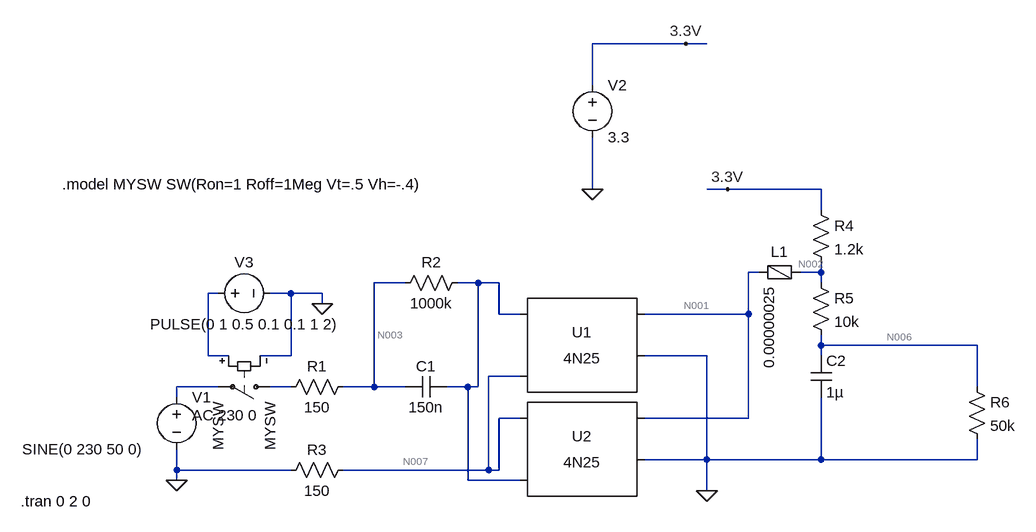
[diagram p0: schematic acmonitor.asc]
acmonitor.asc, the LTspice schematic file:
Version 4
SHEET 1 1156 680
WIRE 640 -384 496 -384
WIRE 672 -384 640 -384
WIRE 496 -320 496 -384
WIRE 496 -160 496 -240
WIRE 704 -160 672 -160
WIRE 848 -160 704 -160
WIRE 848 -128 848 -160
WIRE 752 -32 736 -32
WIRE 848 -32 848 -48
WIRE 848 -32 816 -32
WIRE 208 -16 160 -16
WIRE 320 -16 288 -16
WIRE 352 -16 320 -16
WIRE 848 -16 848 -32
WIRE -80 0 -96 0
WIRE 32 0 0 0
WIRE 80 0 32 0
WIRE 80 16 80 0
WIRE 352 32 352 -16
WIRE 384 32 352 32
WIRE 736 32 736 -32
WIRE 736 32 576 32
WIRE 848 80 848 64
WIRE 1088 80 848 80
WIRE -96 96 -96 0
WIRE -64 96 -96 96
WIRE 32 96 32 0
WIRE 32 96 -16 96
WIRE 672 96 576 96
WIRE 848 96 848 80
WIRE 384 128 336 128
WIRE -80 144 -144 144
WIRE 32 144 0 144
WIRE 160 144 160 -16
WIRE 160 144 112 144
WIRE 208 144 160 144
WIRE 304 144 272 144
WIRE 320 144 320 -16
WIRE 320 144 304 144
WIRE 1088 144 1088 80
WIRE -144 160 -144 144
WIRE 384 192 352 192
WIRE 736 192 736 32
WIRE 736 192 576 192
WIRE 672 256 672 96
WIRE 672 256 576 256
WIRE 848 256 848 160
WIRE 848 256 672 256
WIRE 1088 256 1088 224
WIRE 1088 256 848 256
WIRE -144 272 -144 240
WIRE 32 272 -144 272
WIRE 336 272 336 128
WIRE 336 272 112 272
WIRE 352 272 352 192
WIRE 352 272 336 272
WIRE -144 288 -144 272
WIRE 304 288 304 144
WIRE 384 288 304 288
WIRE 672 304 672 256
FLAG -144 288 0
FLAG 672 304 0
FLAG 496 -160 0
FLAG 640 -384 3.3V
FLAG 704 -160 3.3V
FLAG 80 16 0
SYMBOL res 128 128 R90
WINDOW 0 0 56 VBottom 2
WINDOW 3 32 56 VTop 2
SYMATTR InstName R1
SYMATTR Value 150
SYMBOL res 304 -32 R90
WINDOW 0 0 56 VBottom 2
WINDOW 3 32 56 VTop 2
SYMATTR InstName R2
SYMATTR Value 1000k
SYMBOL cap 272 128 R90
WINDOW 0 0 32 VBottom 2
WINDOW 3 32 32 VTop 2
SYMATTR InstName C1
SYMATTR Value 150n
SYMBOL res 128 256 R90
WINDOW 0 0 56 VBottom 2
WINDOW 3 32 56 VTop 2
SYMATTR InstName R3
SYMATTR Value 150
SYMBOL voltage -144 144 R0
WINDOW 3 -238 96 Left 2
WINDOW 123 24 44 Left 2
WINDOW 39 0 0 Left 0
SYMATTR Value SINE(0 230 50 0)
SYMATTR Value2 AC 230 0
SYMATTR InstName V1
SYMBOL Optos\\4N25 480 96 R0
SYMATTR InstName U1
SYMBOL Optos\\4N25 480 256 R0
SYMATTR InstName U2
SYMBOL res 832 -144 R0
SYMATTR InstName R4
SYMATTR Value 1.2k
SYMBOL voltage 496 -336 R0
WINDOW 123 0 0 Left 0
WINDOW 39 0 0 Left 0
SYMATTR InstName V2
SYMATTR Value 3.3
SYMBOL cap 832 96 R0
SYMATTR InstName C2
SYMATTR Value 1µ
SYMBOL res 832 -32 R0
SYMATTR InstName R5
SYMATTR Value 10k
SYMBOL sw 16 144 R90
SYMATTR InstName MYSW
SYMATTR Value MYSW
SYMBOL voltage -96 0 R270
WINDOW 0 32 56 VTop 2
WINDOW 3 -32 56 VBottom 2
WINDOW 123 0 0 Left 0
WINDOW 39 0 0 Left 0
SYMATTR InstName V3
SYMATTR Value PULSE(0 1 0.5 0.1 0.1 1 2)
SYMBOL res 1072 128 R0
SYMATTR InstName R6
SYMATTR Value 50k
SYMBOL FerriteBead 784 -32 R90
WINDOW 0 -16 0 VBottom 2
SYMATTR InstName L1
SYMATTR Value 0.00000025
SYMATTR SpiceLine Rser=0.25
TEXT -384 320 Left 2 !.tran 0 2 0
TEXT -320 -168 Left 2 !.model MYSW SW(Ron=1 Roff=1Meg Vt=.5 Vh=-.4)

The netlist it stands for:
* acmonitor.asc
R1 N003 N009 150
R2 N004 N003 1000k
C1 N004 N003 150n
R3 N007 0 150
V1 N008 0 SINE(0 230 50 0) AC 230 0
XU1 N004 N007 N001 0 NC_01 4N25
XU2 N007 N004 N001 0 NC_02 4N25
R4 3.3V N002 1.2k
V2 3.3V 0 3.3
C2 N006 0 1µ
R5 N002 N006 10k
S§MYSW N009 N008 N005 0 MYSW
V3 N005 0 PULSE(0 1 0.5 0.1 0.1 1 2)
R6 N006 0 50k
L1 N002 N001 0.00000025 Rser=0.25
.tran 0 2 0
.model MYSW SW(Ron=1 Roff=1Meg Vt=.5 Vh=-.4)
.lib 4N25.sub
.backanno
.end

* Results of the author's LTspice run, read from the files saved beside the schematic
* Operating Point, zero values left out:
*   V(n001) = 3.235 V
*   V(3.3v) = 3.3 V
*   V(n002) = 3.235 V
*   V(n006) = 2.696 V
*   I(L1) = 39.47 pA
*   I(R6) = 53.92 µA
*   I(R5) = 53.92 µA
*   I(R4) = 53.92 µA
*   I(V2) = -53.92 µA
*   Ix(u1:3) = 19.73 pA
*   Ix(u1:4) = -19.73 pA
*   Ix(u2:3) = 19.73 pA
*   Ix(u2:4) = -19.73 pA
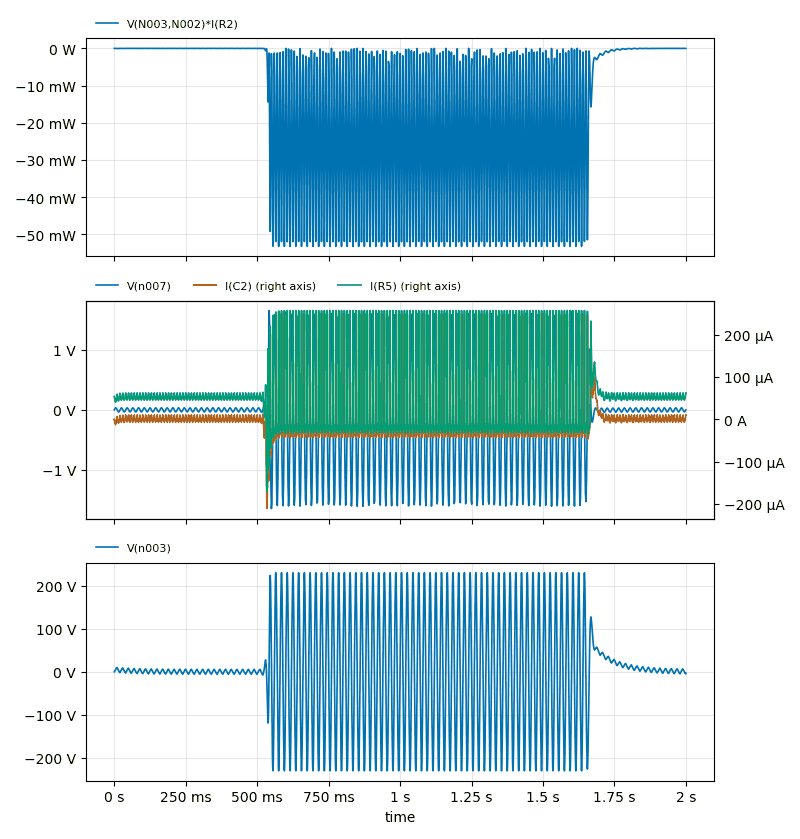
[diagram p1: Transient Analysis of acmonitor.asc, plotted from the saved traces]
* Transient Analysis, 1 run:
*   V(N003,N002)*I(R2): min -53.28 mW, max 4.26 µW, average -14.86 mW, rms 24.2 mW, last -25.67 µW
*   V(n007): min -1.659 V, max 1.653 V, average 335.2 µV, rms 847.6 mV, last 478.7 µV
*   I(C2): min -211 µA, max 248.3 µA, average 155.4 nA, rms 57.45 µA, last 10.21 µA
*   I(R5): min -171.4 µA, max 256.7 µA, average 27.02 µA, rms 67.03 µA, last 62.25 µA
*   V(n003): min -229.9 V, max 229.9 V, average 2.655 V, rms 122 V, last -3.192 V